# Altium schematic sheet SI_Main.SchDoc
size A4
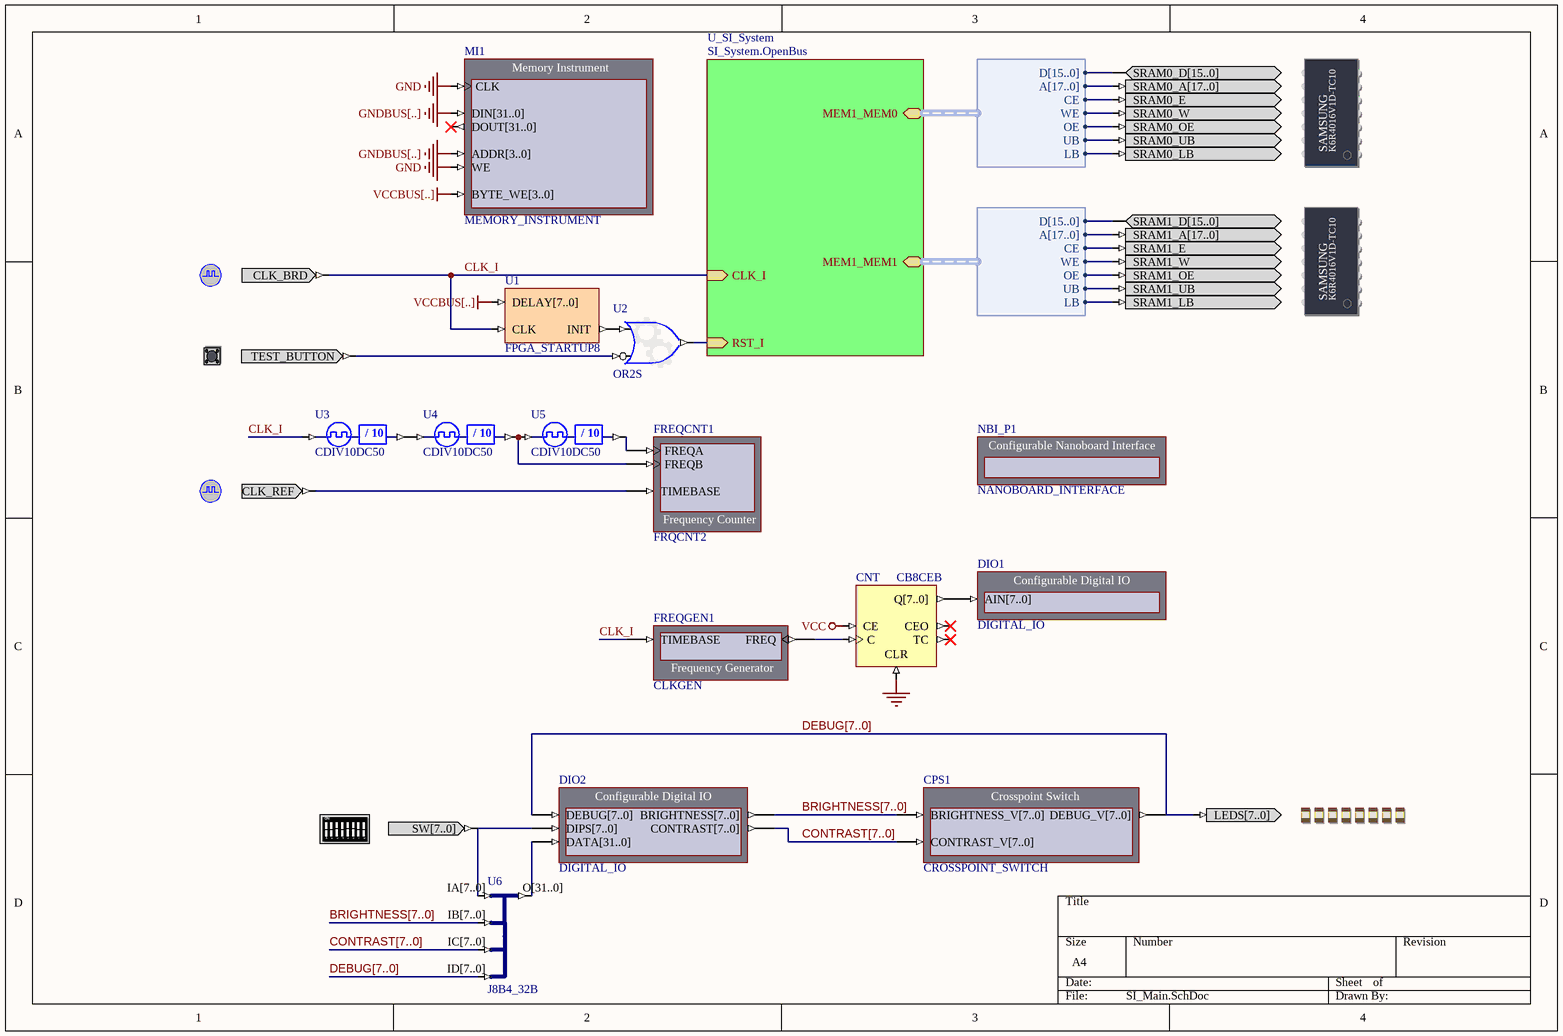
[diagram p0: SI_Main.SchDoc]

## Parts
(Parts that share a designator on the sheet are numbered #1, #2 ... from top to bottom, then left to right.)
?#1  SRAM_DAUGHTER0  (value not drawn)
?#2  SRAM_DAUGHTER1  (value not drawn)
?#3  CLOCK_BOARD  (value not drawn)
?#4  TEST_BUTTON  (value not drawn)
?#5  CLOCK_REFERENCE  (value not drawn)
?#6  LED  (value not drawn)
?#7  DIPSWITCH  (value not drawn)
CNT  CB8CEB
CPS1  CROSSPOINT_SWITCH
DIO1  DIGITAL_IO
DIO2  DIGITAL_IO
FREQCNT1  FRQCNT2
FREQGEN1  CLKGEN
MI1  MEMORY_INSTRUMENT
NBI_P1  NANOBOARD_INTERFACE
U1  FPGA_STARTUP8
U2  OR2S
U3  CDIV10DC50
U4  CDIV10DC50
U5  CDIV10DC50
U6  J8B4_32B

## Sub-sheets
U_SI_System = SI_System.OpenBus: MEM1_MEM0 (harness WB_MEM_CTRL_SRAM16_A18), MEM1_MEM1 (harness WB_MEM_CTRL_SRAM16_A18), RST_I (in), CLK_I (in)

## Harnesses
WB_MEM_CTRL_SRAM16_A18: D[15..0], A[17..0], CE, WE, OE, UB, LB

## Nets
GND: CNT.CLR MI1.CLK MI1.WE
GNDBUS[..]: MI1.ADDR[3..0] MI1.DIN[31..0]
VCC: CNT.CE
VCCBUS[..]: MI1.BYTE_WE[3..0] U1.DELAY[7..0]
BRIGHTNESS[7..0]: CPS1.BRIGHTNESS_V[7..0] DIO2.BRIGHTNESS[7..0] U6.IB[7..0]
CLK_I: ?#3.CLK_BRD FREQGEN1.TIMEBASE U1.CLK U3.CLKIN ; sheet U_SI_System/CLK_I
CONTRAST[7..0]: CPS1.CONTRAST_V[7..0] DIO2.CONTRAST[7..0] U6.IC[7..0]
DEBUG[7..0]: ?#6.LEDS[7..0] CPS1.DEBUG_V[7..0] DIO2.DEBUG[7..0] U6.ID[7..0]
Net?#1_SRAM0_A[17..0]: ?#1.SRAM0_A[17..0] ; sheet U_SI_System/MEM1_MEM0.A[17..0]
Net?#1_SRAM0_D[15..0]: ?#1.SRAM0_D[15..0] ; sheet U_SI_System/MEM1_MEM0.D[15..0]
Net?#1_SRAM0_E: ?#1.SRAM0_E ; sheet U_SI_System/MEM1_MEM0.CE
Net?#1_SRAM0_LB: ?#1.SRAM0_LB ; sheet U_SI_System/MEM1_MEM0.LB
Net?#1_SRAM0_OE: ?#1.SRAM0_OE ; sheet U_SI_System/MEM1_MEM0.OE
Net?#1_SRAM0_UB: ?#1.SRAM0_UB ; sheet U_SI_System/MEM1_MEM0.UB
Net?#1_SRAM0_W: ?#1.SRAM0_W ; sheet U_SI_System/MEM1_MEM0.WE
Net?#2_SRAM1_A[17..0]: ?#2.SRAM1_A[17..0] ; sheet U_SI_System/MEM1_MEM1.A[17..0]
Net?#2_SRAM1_D[15..0]: ?#2.SRAM1_D[15..0] ; sheet U_SI_System/MEM1_MEM1.D[15..0]
Net?#2_SRAM1_E: ?#2.SRAM1_E ; sheet U_SI_System/MEM1_MEM1.CE
Net?#2_SRAM1_LB: ?#2.SRAM1_LB ; sheet U_SI_System/MEM1_MEM1.LB
Net?#2_SRAM1_OE: ?#2.SRAM1_OE ; sheet U_SI_System/MEM1_MEM1.OE
Net?#2_SRAM1_UB: ?#2.SRAM1_UB ; sheet U_SI_System/MEM1_MEM1.UB
Net?#2_SRAM1_W: ?#2.SRAM1_W ; sheet U_SI_System/MEM1_MEM1.WE
Net?#4_TEST_BUTTON: ?#4.TEST_BUTTON U2.I1
Net?#5_CLK_REF: ?#5.CLK_REF FREQCNT1.TIMEBASE
Net?#7_SW[7..0]: ?#7.SW[7..0] DIO2.DIPS[7..0] U6.IA[7..0]
NetCNT_C: CNT.C FREQGEN1.FREQ
NetCNT_Q[7..0]: CNT.Q[7..0] DIO1.AIN[7..0]
NetDIO2_DATA[31..0]: DIO2.DATA[31..0] U6.O[31..0]
NetFREQCNT1_FREQA: FREQCNT1.FREQA U5.CLKDV
NetFREQCNT1_FREQB: FREQCNT1.FREQB U4.CLKDV U5.CLKIN
NetU1_INIT: U1.INIT U2.I0
NetU2_O: U2.O ; sheet U_SI_System/RST_I
NetU3_CLKDV: U3.CLKDV U4.CLKIN

Not connected (* = marked no-connect by the designer): CNT CEO* TC*; MI1 DOUT[31..0]*

## Buses and harness runs
bus BRIGHTNESS[7..0]
bus CONTRAST[7..0]
bus DEBUG[7..0]

## Notes on the sheet
- (in symbol CDIV10DC50) / 10
- (in symbol DIPSWITCH) ON; 1; 2; 3; 4; 5; 6; 7; 8
- (in symbol MEMORY_INSTRUMENT) Memory Instrument
- (in symbol SRAM_DAUGHTER0) SAMSUNG; K6R4016V1D-TC10
- (in symbol SRAM_DAUGHTER1) SAMSUNG; K6R4016V1D-TC10

## Library data of the parts
?#1 = SRAM_DAUGHTER0: Free Static RAM - Daughterboard; PortComponent: True; Published: 14-May-2007; Publisher: Altium Limited; HelpURL: TR0149 Technical Reference for Altium's Xilinx Spartan-3 Daughter Board DB30.pdf#page=16
?#2 = SRAM_DAUGHTER1: Free Static RAM - Daughterboard; PortComponent: True; Published: 14-May-2007; Publisher: Altium Limited; HelpURL: TR0149 Technical Reference for Altium's Xilinx Spartan-3 Daughter Board DB30.pdf#page=16
?#3 = CLOCK_BOARD: Global System Clock Supply; PortComponent: True; Published: 19-Nov-2003; Publisher: Altium Limited; HelpURL: TR0143 Technical Reference Manual for Altium's Desktop NanoBoard NB2DSK01.pdf#page=41; UseInDSF: True
?#4 = TEST_BUTTON: Test / Reset Button; PortComponent: True; Published: 19-Nov-2003; Publisher: Altium Limited; HelpURL: TR0143 Technical Reference Manual for Altium's Desktop NanoBoard NB2DSK01.pdf#page=53
?#5 = CLOCK_REFERENCE: Global System Clock Reference Supply; PortComponent: True; Published: 19-Nov-2003; Publisher: Altium Limited; HelpURL: TR0102 NanoBoard Technical Reference Manual - NB1.pdf#page=29
?#6 = LED: Bank of eight Red LEDs; PortComponent: True; Published: 19-Nov-2003; Publisher: Altium Limited; HelpURL: https://wiki.altium.com/display/ADOH/NB2DSK01+-+User+LEDs
?#7 = DIPSWITCH: 8-Way Dip-Switch; PortComponent: True; Published: 19-Nov-2003; Publisher: Altium Limited; HelpURL: https://wiki.altium.com/display/ADOH/NB2DSK01+-+User+DIP-Switch
CNT = CB8CEB: 8-Bit Cascadable Binary Counters with Clock Enable and Asynchronous Clear, Bus Version; Xilinx Equivalent: CB8CE; ArchiveName: GENERIC; Published: 18-Dec-2003; Publisher: Altium Limited; Core Revision: 1.00.00
CPS1 = CROSSPOINT_SWITCH: Crosspoint Switch; NEXUS_CORE: Instrument; NEXUS_JTAG_DEVICE: True; NEXUS_JTAG_ORDER: 0; ConfigurationParameters: {}Version[1.0]{}Structure0Name[V{1}7..0{2}]{}Input0Name[BRIGHTNESS]{}Input1Name[CONTRAST]{}Output0Name[DEBUG]{}Output0Connection[CONTRAST]{}; ConfiguratorName: CrosspointSwitch; ComponentLink1Description: Core &Resource Usage; Core Revision: 1.00.00; LastRevisionNo: 1.00.00; Published: 04-Jul-2007; Publisher: Altium Limited
DIO1 = DIGITAL_IO: Configurable Digital IO; NEXUS_CORE: Instrument; NEXUS_JTAG_DEVICE: True; NEXUS_JTAG_ORDER: 0; ConfigurationParameters: {}Version[2.0]{}StorageType[3]{}InterfaceType[Parallel]{}SchCompWidth[140]{}Input0Name[AIN{1}7..0{2}]{}Input0Width[8]{}Input0InitValue[0]{}Input0Kind[LEDs]{}Input0LEDStyle[Red]{}NoOutputs[ ]{}Designator[DIO1]{}InternalID[1]{}; ConfiguratorName: DIGITAL_IO; ComponentLink1Description: Core &Resource Usage; ComponentLink1URL: CR0134 FPGA Instrument Resource Usage.pdf; Core Revision: 1.00.00; HelpURL: CR0179 DIGITAL_IO Configurable Digital IO Module.pdf; LastRevisionNo: 1.00.00; Published: 28-Jun-2007; Publisher: Altium Limited; UseInDSF: True
DIO2 = DIGITAL_IO: Configurable Digital IO; NEXUS_CORE: Instrument; NEXUS_JTAG_DEVICE: True; NEXUS_JTAG_ORDER: 0; ConfigurationParameters: {}Version[2.0]{}StorageType[3]{}InterfaceType[Parallel]{}SchCompWidth[140]{}Input0Name[DEBUG{1}7..0{2}]{}Input0Width[8]{}Input0InitValue[0]{}Input0Kind[Bar]{}Input0BarStyle[Black]{}Input1Name[DIPS{1}7..0{2}]{}Input1Width[8]{}Input1InitValue[0]{}Input1Kind[LEDs]{}Input1LEDStyle[Red]{}Input2Name[DATA{1}31..0{2}]{}Input2Width[32]{}Input2InitValue[0]{}Input2Kind[LED Digits]{}Input2SegStyle[Green]{}Input2SegRadix[Hexadecimal]{}Output0Name[BRIGHTNESS{1}7..0{2}]{}Output0Width[8]{}Output0InitValue[170]{}Output0Kind[Slider]{}Output1Name[CONTRAST{1}7..0{2}]{}Output1Width[8]{}Output1InitValue[85]{}Output1Kind[Slider]{}Designator[DIO2]{}InternalID[2]{}; ConfiguratorName: DIGITAL_IO; ComponentLink1Description: Core &Resource Usage; ComponentLink1URL: CR0134 FPGA Instrument Resource Usage.pdf; Core Revision: 1.00.00; HelpURL: CR0102 IOB_x Digital IO Module.pdf; LastRevisionNo: 1.00.00; Published: 28-Jun-2007; Publisher: Altium Limited
FREQCNT1 = FRQCNT2: Frequency Counter; NEXUS_CORE: Instrument; NEXUS_JTAG_DEVICE: True; NEXUS_JTAG_ORDER: 0; Published: 3-Nov-2004; Publisher: Altium Limited; Core Revision: 1.00.00; ComponentLink1Description: Core &Resource Usage; ComponentLink1URL: CR0134 FPGA Instrument Resource Usage.pdf#page=3; HelpURL: CR0101 FRQCNT2 Frequency Counter.pdf; LastRevisionNo: 1.00.00
FREQGEN1 = CLKGEN: Frequency Generator; NEXUS_CORE: Instrument; NEXUS_JTAG_DEVICE: True; NEXUS_JTAG_ORDER: 0; Published: 3-Nov-2004; Publisher: Altium Limited; Core Revision: 1.00.00; ComponentLink1Description: Core &Resource Usage; ComponentLink1URL: CR0134 FPGA Instrument Resource Usage.pdf#page=2; HelpURL: https://wiki.altium.com/display/ADOH/Frequency+Generator+Module; LastRevisionNo: 1.00.00
MI1 = MEMORY_INSTRUMENT: Configurable Memory Instrument; NEXUS_JTAG_DEVICE: True; NEXUS_JTAG_ORDER: 0; ConfigurationParameters: {}Version[1.0]{}Option_MemoryDepthText[16]{}Option_MemoryWidth[32]{}Option_MemoryType[0]{}Option_ByteWrites[True]{}Option_RisingEdgeClock[True]{}Option_UseDistributed[False]{}Option_InitMemoryFlag[False]{}Option_MemoryFileName[ ]{}InternalID[5]{}; NEXUS_CORE: Instrument; ConfiguratorName: MEMORY_INSTRUMENT; ComponentLink1Description: Core &Resource Usage; ComponentLink1URL: CR0134 FPGA Instrument Resource Usage.pdf; Core Revision: 1.00.00; LastRevisionNo: 1.00.00; Published: 13-Feb-2009; Publisher: Altium Limited
NBI_P1 = NANOBOARD_INTERFACE: Configurable Nanoboard Interface; NEXUS_CORE: Instrument; NEXUS_JTAG_DEVICE: True; NEXUS_JTAG_ORDER: 0; ConfiguratorName: DIGITAL_IO_APPLICATION; ConfigurationParameters: {}Version[1.0]{}StorageType[0]{}SubProjectPath[NBI\NBIScript.PrjScr]{}ID[First IC Test]{}DisabledInDashboard[False]{}AutoRun[True]{}; ComponentLink1Description: Core &Resource Usage; ComponentLink1URL: CR0134 FPGA Instrument Resource Usage.pdf; Core Revision: 1.00.00; LastRevisionNo: 1.00.00; Published: 06-May-2009; Publisher: Altium Limited
U1 = FPGA_STARTUP8: FPGA Startup With 8 Bit Delay; Published: 9-Dec-2004; Publisher: Altium Limited; HelpURL: CR0119 FPGA_STARTUPx Powerup Delay Unit.pdf; LastRevisionNo: 1.00.00; ComponentLink1Description: Core &Resource Usage; ComponentLink1URL: CR0139 FPGA Peripheral Resource Usage.pdf#page=11
U2 = GATE: Configurable Generic Gate; ConfiguratorName: GENERIC_GATE; ConfigurationParameters: {}Version[1.0]{}GateKind[OR]{}BusInput[False]{}GateInputType[Bit]{}GateOutputOption[Normal]{}BusWidth[8]{}RegisterOutputs[False]{}NegativeClockEdge[False]{}InputCount[2]{}InputInvert0[False]{}InputInvert1[True]{}; LastRevisionNo: 1.00.00; Published: 3-Sep-2008; Publisher: Altium Limited
U3-U5 = CDIV10DC50: Clock Divider by 10 with 50% Duty Cycle Output; XilinxEquivalent: CLK_DIV10; DivisorRate: 10; DutyCycle: 50; ArchiveName: GENERIC; VHDLIB_SIM: GENERIC_LIB; Published: 29-Jan-2004; Publisher: Altium Limited; LastRevisionNo: 1.00.00; HelpURL: CR0118 FPGA Generic Library Guide.pdf#page=143; ComponentLink1URL: CR0127 FPGA Clock Divider Resource Usage.pdf#page=15; ComponentLink1Description: Core &Resource Usage; FunctionalClass: Clock Divider
U6 = J8B4_32B: 4 x 8-Bit input bus to 1 x 32-bit output bus; FunctionalClass: Bus Joiner; PortSize: 8; ArchiveName: GENERIC; VHDLIB_SIM: GENERIC_LIB; Published: 29-Jan-2004; Publisher: Altium Limited; LastRevisionNo: 1.00.00; HelpURL: CR0118 FPGA Generic Library Guide.pdf#page=302; ComponentLink1URL: CR0126 FPGA Bus Joiner Resource Usage.pdf#page=24; ComponentLink1Description: Core &Resource Usage